# Altium schematic sheet controller.SchDoc: supply
size A4; SheetNumber: 1; SheetTotal: 1
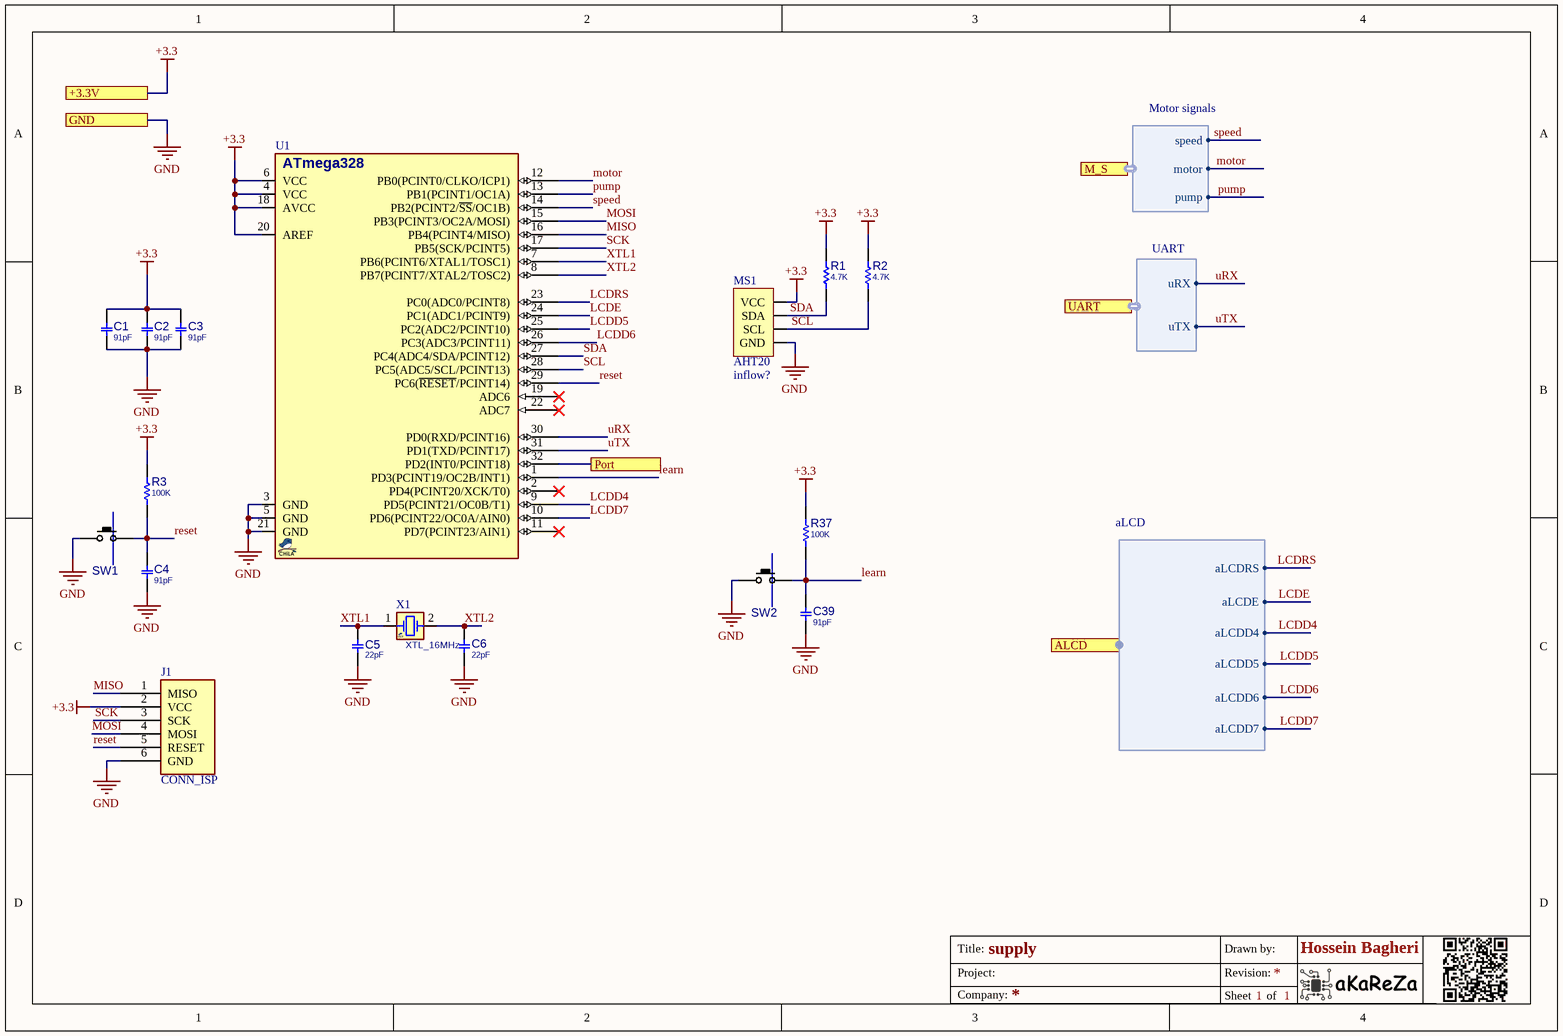
[diagram p0: controller.SchDoc]

## Parts
C1  91pF  [C0805]
C2  91pF  [C0805]
C3  91pF  [C0805]
C4  91pF  [C0805]
C5  22pF  [C0805]
C6  22pF  [C0805]
C39  91pF  [C0805]
J1  CONN_ISP  [IDC_2X3]
MS1  Inflow: inflow?  [AHT20]  (hidden comment: AHT20)
R1  4.7K  [R0805]
R2  4.7K  [R0805]
R3  100K  [R0805]
R37  100K  [R0805]
SW1  PUSHBUTTON  [SWPBS_SPST_6X3X2]  (value not drawn)
SW2  PUSHBUTTON  [SWPBS_SPST_6X3X2]  (value not drawn)
U1  ATMEGA328  [QFG80_32]  (value not drawn)
X1  XTL_16MHz  [XTL_2_11X5]

## Ports
+3.3V, ALCD (harness aLCD), GND, M_S (harness Motor signals), Port, UART (harness UART)

## Harnesses
Motor signals: speed, motor, pump
UART: uRX, uTX
aLCD: aLCDRS, aLCDE, aLCDD4, aLCDD5, aLCDD6, aLCDD7

## Nets
+3.3: C1.2 C2.2 C3.2 J1.2(VCC) MS1.4(VCC) R1.2 R2.2 R3.2 R37.2 U1.4(VCC) U1.6(VCC) U1.18(AVCC) U1.20(AREF) ; port +3.3V
GND: C1.1 C2.1 C3.1 C4.1 C5.1 C6.1 C39.1 J1.6(GND) MS1.3(GND) SW1.1(P1) SW2.1(P1) U1.3(GND) U1.5(GND) U1.21(GND) ; port GND
LCDD4: U1.9(PD5(PCINT21/OC0B/T1)) ; port ALCD.aLCDD4
LCDD5: U1.25(PC2(ADC2/PCINT10)) ; port ALCD.aLCDD5
LCDD6: U1.26(PC3(ADC3/PCINT11)) ; port ALCD.aLCDD6
LCDD7: U1.10(PD6(PCINT22/OC0A/AIN0)) ; port ALCD.aLCDD7
LCDE: U1.24(PC1(ADC1/PCINT9)) ; port ALCD.aLCDE
LCDRS: U1.23(PC0(ADC0/PCINT8)) ; port ALCD.aLCDRS
learn: C39.2 R37.1 SW2.2(P3) U1.1(PD3(PCINT19/OC2B/INT1))
MISO: J1.1(MISO) U1.16(PB4(PCINT4/MISO))
MOSI: J1.4(MOSI) U1.15(PB3(PCINT3/OC2A/MOSI))
motor: U1.12(PB0(PCINT0/CLKO/ICP1)) ; port M_S.motor
Port: U1.32(PD2(INT0/PCINT18)) ; port Port
pump: U1.13(PB1(PCINT1/OC1A)) ; port M_S.pump
reset: C4.2 J1.5(RESET) R3.1 SW1.2(P3) U1.29(PC6(~{RESET}/PCINT14))
SCK: J1.3(SCK) U1.17(PB5(SCK/PCINT5))
SCL: MS1.2(SCL) R2.1 U1.28(PC5(ADC5/SCL/PCINT13))
SDA: MS1.1(SDA) R1.1 U1.27(PC4(ADC4/SDA/PCINT12))
speed: U1.14(PB2(PCINT2/~{SS}/OC1B)) ; port M_S.speed
uRX: U1.30(PD0(RXD/PCINT16)) ; port UART.uRX
uTX: U1.31(PD1(TXD/PCINT17)) ; port UART.uTX
XTL1: C5.2 U1.7(PB6(PCINT6/XTAL1/TOSC1)) X1.1(OSC1)
XTL2: C6.2 U1.8(PB7(PCINT7/XTAL2/TOSC2)) X1.2(OSC2)

Not connected (* = marked no-connect by the designer): U1 2(PD4(PCINT20/XCK/T0))* 11(PD7(PCINT23/AIN1))* 19(ADC6)* 22(ADC7)*

## Notes on the sheet
- Title:
- Project:
- Drawn by:
- Revision:
- Hossein Bagheri
- Company:
- Sheet
- of
- (in symbol ATMEGA328_QFP32) ATmega328

## Library data of the parts
C1-C6 C39 = CAP_SMD_MLCC_2.2u50V_0805: CAP, MLCC; MANF_P#: UMK212ABJ225KG-T; MANF: Taiyo Yuden; PARAM: X5R, 10%; DIST#: MOUSER; PARAM2: 50V; ASSEMBLY: ASSEMBLY; PRICE: 100= 10$; DESC: CAP, MLCC
  C1-C4 C39: VALUE: 91pF
  C5 C6: VALUE: 22pF
J1 = CONN_AVR_ISP_IDC6: CONN, ISP, AVR , HEADER BOX; VALUE: CONN_ISP
MS1 = ModSen_AHT20: Air Temperature and Humidity Sensor; Rating: Rating?; Validation: Valid; Package: Dip; Type: Air T&H; Value: AHT20
R1-R3 R37 = RES_SMD_0805: RESISTOR, SMD; PARAM: -W; DESC: DESCRIPTION; DIST#: MOUSER; PARAM2: 1%; MANF_P#: -; MANF: -; ASSEMBLY: ASSEMBLY; PRICE: 100= 0.5$
  R1 R2: VALUE: 4.7K
  R3 R37: VALUE: 100K
SW1 SW2 = SWPBS_SPST_6X3X2_RS282: SWITCH, PUSH BUTTON, TACTILE, SMD, SPST, 6X3.5X2.5mm; MANF: C&K; DESC: DESCRIPTION; MANF_P#: RS-282G05A3-SM RT; VALUE: PUSHBUTTON; ASSEMBLY: ASSEMBLY; PARAM: PARAM; PRICE: 0.8$
U1 = ATMEGA328_QFP32: MCU, AVR, 8-Bit, 16KB, 1KB RAM, 20MHz; PART#ALT: ATmega8-48-88-168-328; MANF_P#: ATMEGA328-AU; DESC: 1KB EEPROM; MANF: ATMEL/MICROCHIP; PARAM2: 1.8~5.5V; PARAM: 32KB, 2KB RAM, 20MHz, -40~85°C; PRICE: 2.2$; VALUE: ATMEGA328
X1 = XTL_2_HC49_8MHz_SMD: Crystal MOST POPULAR ABL HC49 PACKAGE; MANF: ABRACON; MANF_P#: ABLS-8.000MHZ-B4-T; PARAM: 8MHz, 18pF, 30PPM, -20~70oC; PRICE: 0.3$; VALUE: XTL_16MHz